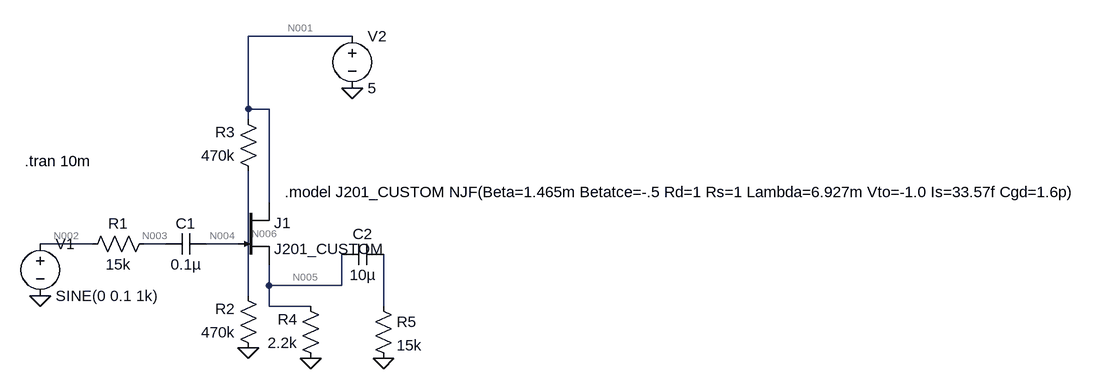
[diagram p0: schematic Draft1.asc]
Draft1.asc, the LTspice schematic file:
Version 4.1
SHEET 1 1564 680
WIRE 336 -144 176 -144
WIRE 176 -32 176 -144
WIRE 208 -32 176 -32
WIRE 176 -16 176 -32
WIRE 208 112 208 -32
WIRE -64 176 -144 176
WIRE 48 176 16 176
WIRE 160 176 112 176
WIRE 208 240 208 208
WIRE 320 240 320 192
WIRE 320 240 208 240
WIRE 176 256 176 64
WIRE 208 272 208 240
WIRE 272 272 208 272
WIRE 384 272 384 192
FLAG -144 256 0
FLAG 336 -64 0
FLAG 176 336 0
FLAG 272 352 0
FLAG 384 352 0
SYMBOL njf 160 112 R0
SYMATTR InstName J1
SYMATTR Value J201_CUSTOM
SYMBOL res 32 160 R90
WINDOW 0 0 56 VBottom 2
WINDOW 3 32 56 VTop 2
SYMATTR InstName R1
SYMATTR Value 15k
SYMBOL res 192 352 R180
WINDOW 0 36 76 Left 2
WINDOW 3 36 40 Left 2
SYMATTR InstName R2
SYMATTR Value 470k
SYMBOL res 192 80 R180
WINDOW 0 36 76 Left 2
WINDOW 3 36 40 Left 2
SYMATTR InstName R3
SYMATTR Value 470k
SYMBOL res 288 368 R180
WINDOW 0 36 76 Left 2
WINDOW 3 36 40 Left 2
SYMATTR InstName R4
SYMATTR Value 2.2k
SYMBOL cap 112 160 R90
WINDOW 0 0 32 VBottom 2
WINDOW 3 32 32 VTop 2
SYMATTR InstName C1
SYMATTR Value 0.1µ
SYMBOL cap 384 176 R90
WINDOW 0 0 32 VBottom 2
WINDOW 3 32 32 VTop 2
SYMATTR InstName C2
SYMATTR Value 10µ
SYMBOL voltage -144 160 R0
WINDOW 123 0 0 Left 0
WINDOW 39 0 0 Left 0
SYMATTR InstName V1
SYMATTR Value SINE(0 0.1 1k)
SYMBOL voltage 336 -160 R0
WINDOW 123 0 0 Left 0
WINDOW 39 0 0 Left 0
SYMATTR InstName V2
SYMATTR Value 5
SYMBOL res 368 256 R0
SYMATTR InstName R5
SYMATTR Value 15k
TEXT 232 96 Left 2 !.model J201_CUSTOM NJF(Beta=1.465m Betatce=-.5 Rd=1 Rs=1 Lambda=6.927m Vto=-1.0 Is=33.57f Cgd=1.6p)
TEXT -168 48 Left 2 !.tran 10m

The netlist it stands for:
* Draft1.asc
J1 N001 N004 N005 J201_CUSTOM
R1 N003 N002 15k
R2 0 N006 470k
R3 N006 N001 470k
R4 0 N005 2.2k
C1 N004 N003 0.1µ
C2 N007 N005 10µ
V1 N002 0 SINE(0 0.1 1k)
V2 N001 0 5
R5 N007 0 15k
.model NJF NJF
.model PJF PJF
.lib standard.jft
.model J201_CUSTOM NJF(Beta=1.465m Betatce=-.5 Rd=1 Rs=1 Lambda=6.927m Vto=-1.0 Is=33.57f Cgd=1.6p)
.tran 10m
.backanno
.end

* Results of the author's LTspice run, read from the files saved beside the schematic
* Operating Point, zero values left out:
*   V(n001) = 5 V
*   V(n004) = 2.581 V
*   V(n005) = 2.676 V
*   V(n006) = 2.5 V
*   I(R2) = -5.319 µA
*   I(R3) = -5.319 µA
*   I(R4) = -1.216 mA
*   I(V2) = -1.221 mA
*   Id(J1) = 1.216 mA
*   Ig(J1) = -2.581 pA
*   Is(J1) = -1.216 mA
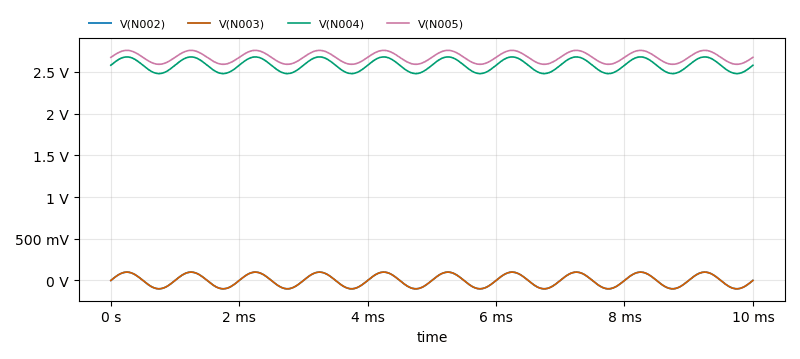
[diagram p1: Transient Analysis of Draft1.asc, plotted from the saved traces]
* Transient Analysis, 1 run:
*   V(N002): min -100 mV, max 100 mV, average 0 V, rms 70.71 mV, last 0 V
*   V(N003): min -100 mV, max 100 mV, average 0 V, rms 70.71 mV, last -8.16 µV
*   V(N004): min 2.481 V, max 2.681 V, average 2.581 V, rms 2.582 V, last 2.581 V
*   V(N005): min 2.592 V, max 2.759 V, average 2.676 V, rms 2.676 V, last 2.676 V